# EAGLE design IR Sensor (EAGLE 9.6.2)
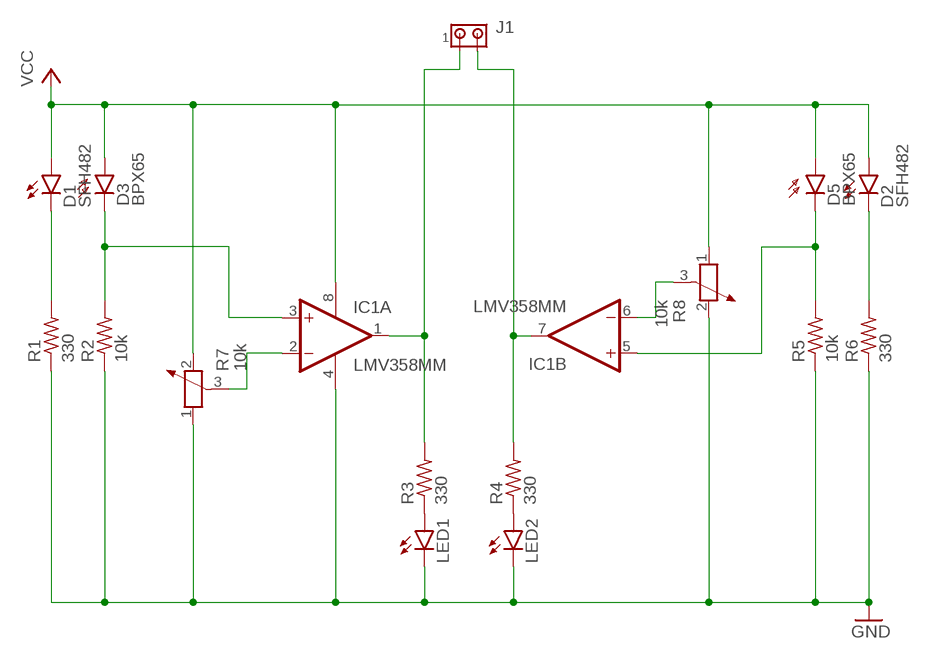
[diagram p0: schematic, sheet 1]

## Parts
D1  SFH482  [SFH482]
D2  SFH482  [SFH482]
D3  BPX65  [BPX65]
D5  BPX65  [BPX65]
IC1  LMV358MM  [MSOP08]
J1  MTA02-100  [10X02MTA]
LED1  LED3MM  [LED3MM]
LED2  LED3MM  [LED3MM]
R1  330  R-US_R0603  [R0603]
R2  10k  R-US_R0603  [R0603]
R3  330  R-US_R0603  [R0603]
R4  330  R-US_R0603  [R0603]
R5  10k  R-US_R0603  [R0603]
R6  330  R-US_R0603  [R0603]
R7  10k  POTENTIOMETER_PT-10  [PT-10]
R8  10k  POTENTIOMETER_PT-10  [PT-10]

## Nets
GND: IC1.4(P:V-) LED1.K(C) LED2.K(C) R1.1 R2.1 R5.1 R6.1 R7.1 R8.2
N$1: LED1.A R3.1
N$2: LED2.A R4.1
N$3: D3.K(C) IC1.3(A:+IN) R2.2
N$5: D1.K(C) R1.2
N$7: D2.K(C) R6.2
N$8: D5.K(C) IC1.5(B:+IN) R5.2
N$9: IC1.2(A:-IN) R7.3
N$10: IC1.1(A:OUT) J1.1 R3.2
N$12: IC1.6(B:-IN) R8.3
N$13: IC1.7(B:OUT) J1.2 R4.2
VCC: D1.A D2.A D3.A D5.A IC1.8(P:V+) R7.2 R8.1

## Library data of the parts
D1 D2 = led:SFH482: IR LED infrared emitting diode, Infineon
D3 D5 = opto-trans-siemens:BPX65: PHOTO DIODE; MPN: BPX65.; OC_FARNELL: 327451; OC_NEWARK: 06WX2764
IC1 = linear:LMV358?*: Dual General Purpose, Low Voltage, Rail-to-Rail Output Operational Amplifiers Source: http://www.national.com/mpf/LM/LMV321.html http://www.national.com/dt/lmv_qual.pdf
J1 = con-amp:MTA02-100: AMP connector
LED1 LED2 = led:LED: LED OSRAM: - CHIPLED LG R971, LG N971, LY N971, LG Q971, LY Q971, LO R971, LY R971 LH N974, LH R974 LS Q976, LO Q976, LY Q976 LO Q996 - Hyper CHIPLED LW Q18S LB Q993, LB Q99A, LB R99A - SideLED LS A670, LO A670, LY A670, LG A670, LP A670 LB A673, LV A673, LT A673, LW A673 LH A674 LY A675 LS A676, LA A676, LO A676, LY A676, LW A676 LS A679, LY A679, LG A679 - Hyper Micro SIDELED® LS Y876, LA Y876, LO Y876, LY Y876 LT Y87S - SmartLED LW L88C, LW L88S LB L89C, LB L89S, LG L890 LS L89K, LO L89K, LY L89K LS L896, LA L896, LO L896, LY L896 - TOPLED LS T670, LO T670, LY T670, LG T670, LP T670 LSG T670, LSP T670, LSY T670, LOP T670, LYG T670 LG T671, LOG T671, LSG T671 LB T673, LV T673, LT T673, LW T673 LH T674 LS T676, LA T676, LO T676, LY T676, LB T676, LH T676, LSB T676, LW T676 LB T67C, LV T67C, LT T67C, LS T67K, LO T67K, LY T67K, LW E67C LS E67B, LA E67B, LO E67B, LY E67B, LB E67C, LV E67C, LT E67C LW T67C LS T679, LY T679, LG T679 LS T770, LO T770, LY T770, LG T770, LP T770 LB T773, LV T773, LT T773, LW T773 LH T774 LS E675, LA E675, LY E675, LS T675 LS T776, LA T776, LO T776, LY T776, LB T776 LHGB T686 LT T68C, LB T68C - Hyper Mini TOPLED® LB M676 - Mini TOPLED Santana® LG M470 LS M47K, LO M47K, LY M47K Source: http://www.osram.convergy.de LUXEON: - LUMILED® LXK2-PW12-R00, LXK2-PW12-S00, LXK2-PW14-U00, LXK2-PW14-V00 LXK2-PM12-R00, LXK2-PM12-S00, LXK2-PM14-U00 LXK2-PE12-Q00, LXK2-PE12-R00, LXK2-PE12-S00, LXK2-PE14-T00, LXK2-PE14-U00 LXK2-PB12-K00, LXK2-PB12-L00, LXK2-PB12-M00, LXK2-PB14-N00, LXK2-PB14-P00, LXK2-PB14-Q00 LXK2-PR12-L00, LXK2-PR12-M00, LXK2-PR14-Q00, LXK2-PR14-R00 LXK2-PD12-Q00, LXK2-PD12-R00, LXK2-PD12-S00 LXK2-PH12-R00, LXK2-PH12-S00 LXK2-PL12-P00, LXK2-PL12-Q00, LXK2-PL12-R00 Source: www.luxeon.com KINGBRIGHT: KA-3528ASYC Source: www.kingbright.com
R1-R6 = rcl:R-US_: RESISTOR, American symbol; SPICEPREFIX: R
R7 R8 = rcl:POTENTIOMETER_: Potentiometer; SPICEMODEL: POT; SPICEPREFIX: X

## Board
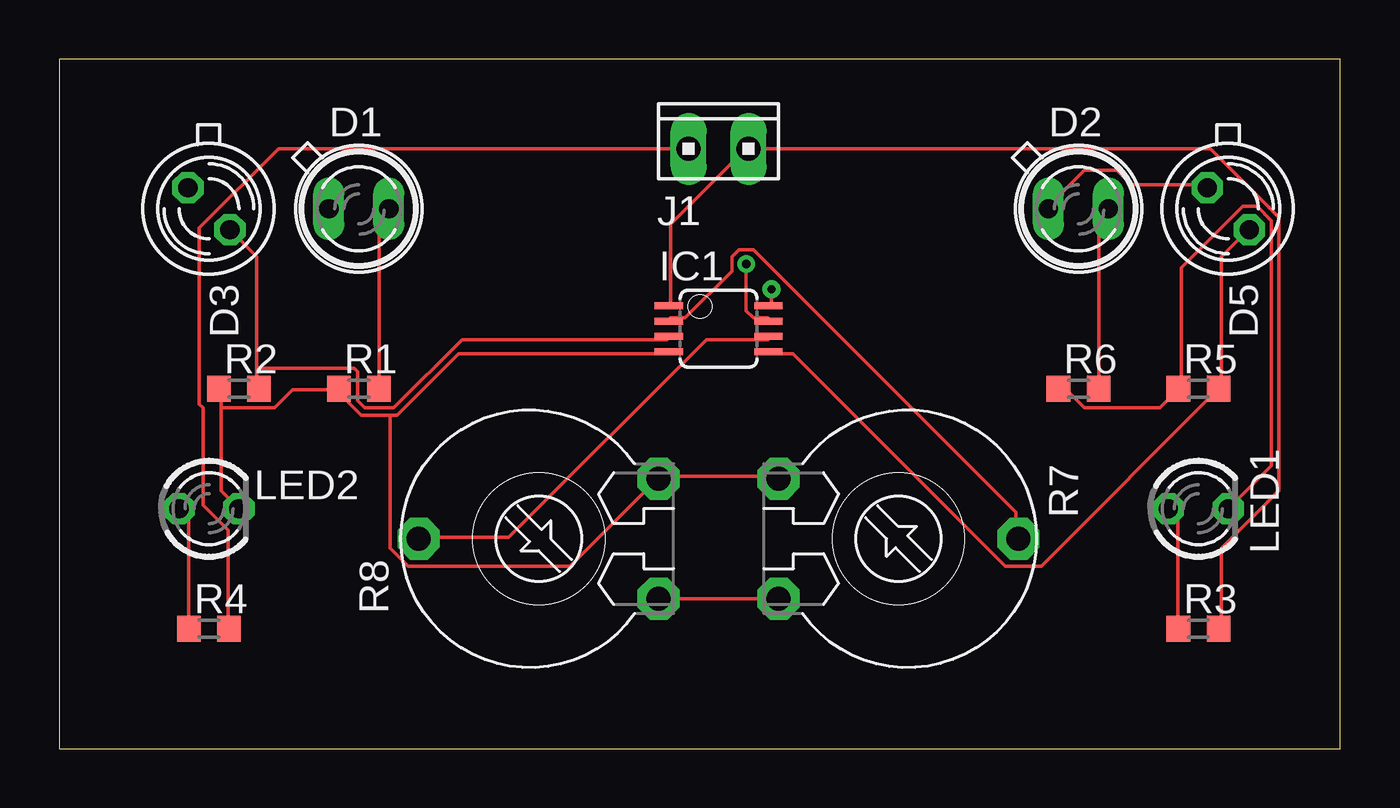
[diagram p1: board, top side]
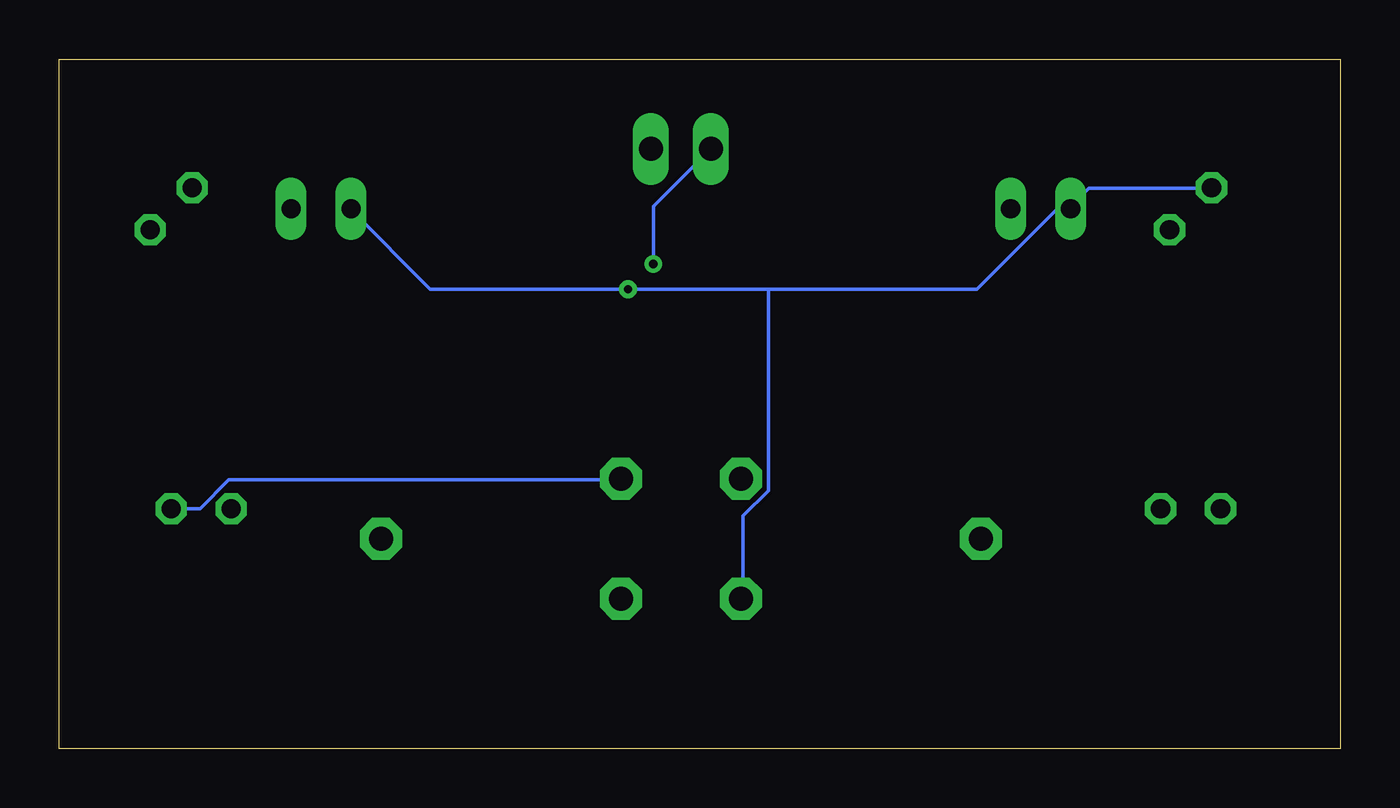
[diagram p2: board, bottom side, seen from below]

Size 54.28 x 29.2 mm. Coordinates in mm from the lower left corner, seen from the top.
Outline: 0,0 54.28,0 54.28,29.2 0,29.2 0,0
Copper layers (1*16): Top 0.035mm / dielectric 1.5mm / Bottom 0.035mm
Design rules "default": minimum track width 6mil, minimum drill 0.35mm, track to track 6mil, track to pad 6mil, pad to pad 6mil, via to via 6mil, smd to smd 6mil, copper to edge 40mil, drill to drill 6mil, minimum pad ring 10mil, minimum via ring 8mil, stop-mask expansion 4mil, vias tented up to drill 0mil, thermal gap 10mil

### Footprints (pad centres in the part's own frame; a part is rotated, then mirrored left to right if it is on the bottom)
SFH482 = drill 0.813 long: A -1.27,0; K 1.27,0
BPX65 = drill 0.813 octagon: A -0.889,-0.889; K 0.889,0.889
MSOP08 = smd 0.3 x 1.2: 1 -0.976,-2.113; 2 -0.326,-2.113; 3 0.324,-2.113; 4 0.974,-2.113; 5 0.974,2.112; 6 0.324,2.112; 7 -0.326,2.112; 8 -0.976,2.112
10X02MTA = drill 1.016 long: 1 1.27,0; 2 -1.27,0
LED3MM = drill 0.813 octagon: A -1.27,0; K 1.27,0
R0603 = smd 1 x 1.1: 1 -0.85,0; 2 0.85,0
PT-10 = drill 1.016 pad 1.778 octagon: 1 -2.54,-5.08; 2 2.54,-5.08; 3 0,5.08

### Placement (x,y rotation side)
D1  12.7,22.86 0 top
D2  43.18,22.86 0 top
D3  6.35,22.86 270 top
D5  49.53,22.86 270 top
IC1  27.94,17.78 270 top
J1  27.94,25.4 0 top
LED1  48.26,10.16 0 top
LED2  6.35,10.16 0 top
R1  12.7,15.24 0 top
R2  7.62,15.24 0 top
R3  48.26,5.08 0 top
R4  6.35,5.08 0 top
R5  48.26,15.24 0 top
R6  43.18,15.24 0 top
R7  35.56,8.89 270 top
R8  20.32,8.89 90 top

### Tracks (layer width: path | path; a pad name or v marks a point on that pad's centre or on a via)
GND
  Top 0.152: 6.86,14.43 6.86,10.92 LED2.K | 6.86,14.43 6.86,15.19 R2.1 | 11.73,15.19 9.91,15.19 9.14,14.43 6.86,14.43 | 14.02,14.12 12.8,14.12 11.73,15.19 | 14.02,14.12 14.33,14.12 16.92,16.71 25.76,16.71 IC1.4 | 11.73,15.19 R1.1 | R6.1 42.37,15.19 42.67,15.19 43.43,14.43 46.63,14.43 47.4,15.19 R5.1 47.55,15.34 47.55,20.37 50.14,22.96 50.75,22.96 51.36,22.35 51.36,11.99 LED1.K | R7.1 30.48,11.53 25.45,11.53 R8.2 25.3,11.38 21.64,7.72 14.78,7.72 14.02,8.48 14.02,14.12
  Bottom 0.152: LED1.K 48.31,10.16 47.09,11.38 30.48,11.38 R7.1
N$1
  Top 0.152: R3.1 47.4,5.13 47.4,9.86 47.09,10.16 LED1.A
N$2
  Top 0.152: R4.1 5.49,5.13 5.49,9.86 5.18,10.16 LED2.A
N$3
  Top 0.152: 8.38,16.1 8.38,20.83 D3.K | 8.38,16.1 8.38,15.34 R2.2 | 8.38,16.1 12.5,16.1 12.65,15.95 12.65,14.73 12.95,14.43 14.17,14.43 17.07,17.32 25.76,17.32 IC1.3
N$5
  Top 0.152: R1.2 13.56,15.34 13.56,22.5 13.87,22.81 D1.K
N$7
  Top 0.152: R6.2 44.04,15.34 44.04,22.5 44.35,22.81 D2.K
N$8
  Top 0.152: D5.K 50.29,21.89 49.23,20.83 49.23,15.34 R5.2 49.07,15.19 41.61,7.72 40.08,7.72 31.09,16.71 30.18,16.71 IC1.5
N$9
  Top 0.152: IC1.2 25.91,18.24 26.52,18.24 28.5,20.22 28.5,20.83 28.8,21.13 29.41,21.13 40.54,10.01 40.54,8.94 R7.3
N$10
  Top 0.152: R3.2 49.23,5.13 49.23,8.48 51.66,10.92 51.66,22.5 48.77,25.4 J1.1 29.11,25.4 25.91,22.2 25.91,18.85 IC1.1
N$12
  Top 0.152: IC1.6 30.02,17.32 27.43,17.32 19.05,8.94 15.24,8.94 R8.3
N$13  (via drill 0.35)
  Top 0.152: J1.2 9.3,25.4 5.94,22.05 5.94,14.58 6.1,14.43 6.1,10.31 7.16,9.25 7.16,5.13 R4.2 | v29.11,20.52 29.11,18.54 29.41,18.24 30.02,18.24 IC1.7
  Bottom 0.152: v29.11,20.52 29.11,22.96 J1.2
VCC  (via drill 0.35)
  Top 0.152: R7.2 R8.1 | v30.18,19.46 30.18,18.85 IC1.8 | D5.A 48.62,23.88 45.41,23.88 44.81,24.49 43.43,24.49 41.91,22.96 D2.A
  Bottom 0.152: D3.A 5.49,23.72 10.67,23.72 11.43,22.96 D1.A 11.43,22.81 12.04,22.81 15.39,19.46 24.23,19.46 | D2.A 41.91,22.81 38.56,19.46 v30.18,19.46 24.23,19.46 | 24.23,19.46 24.23,10.92 25.3,9.86 25.3,6.35 R8.1